# EAGLE schematic SingleFader (EAGLE 7.4.0)
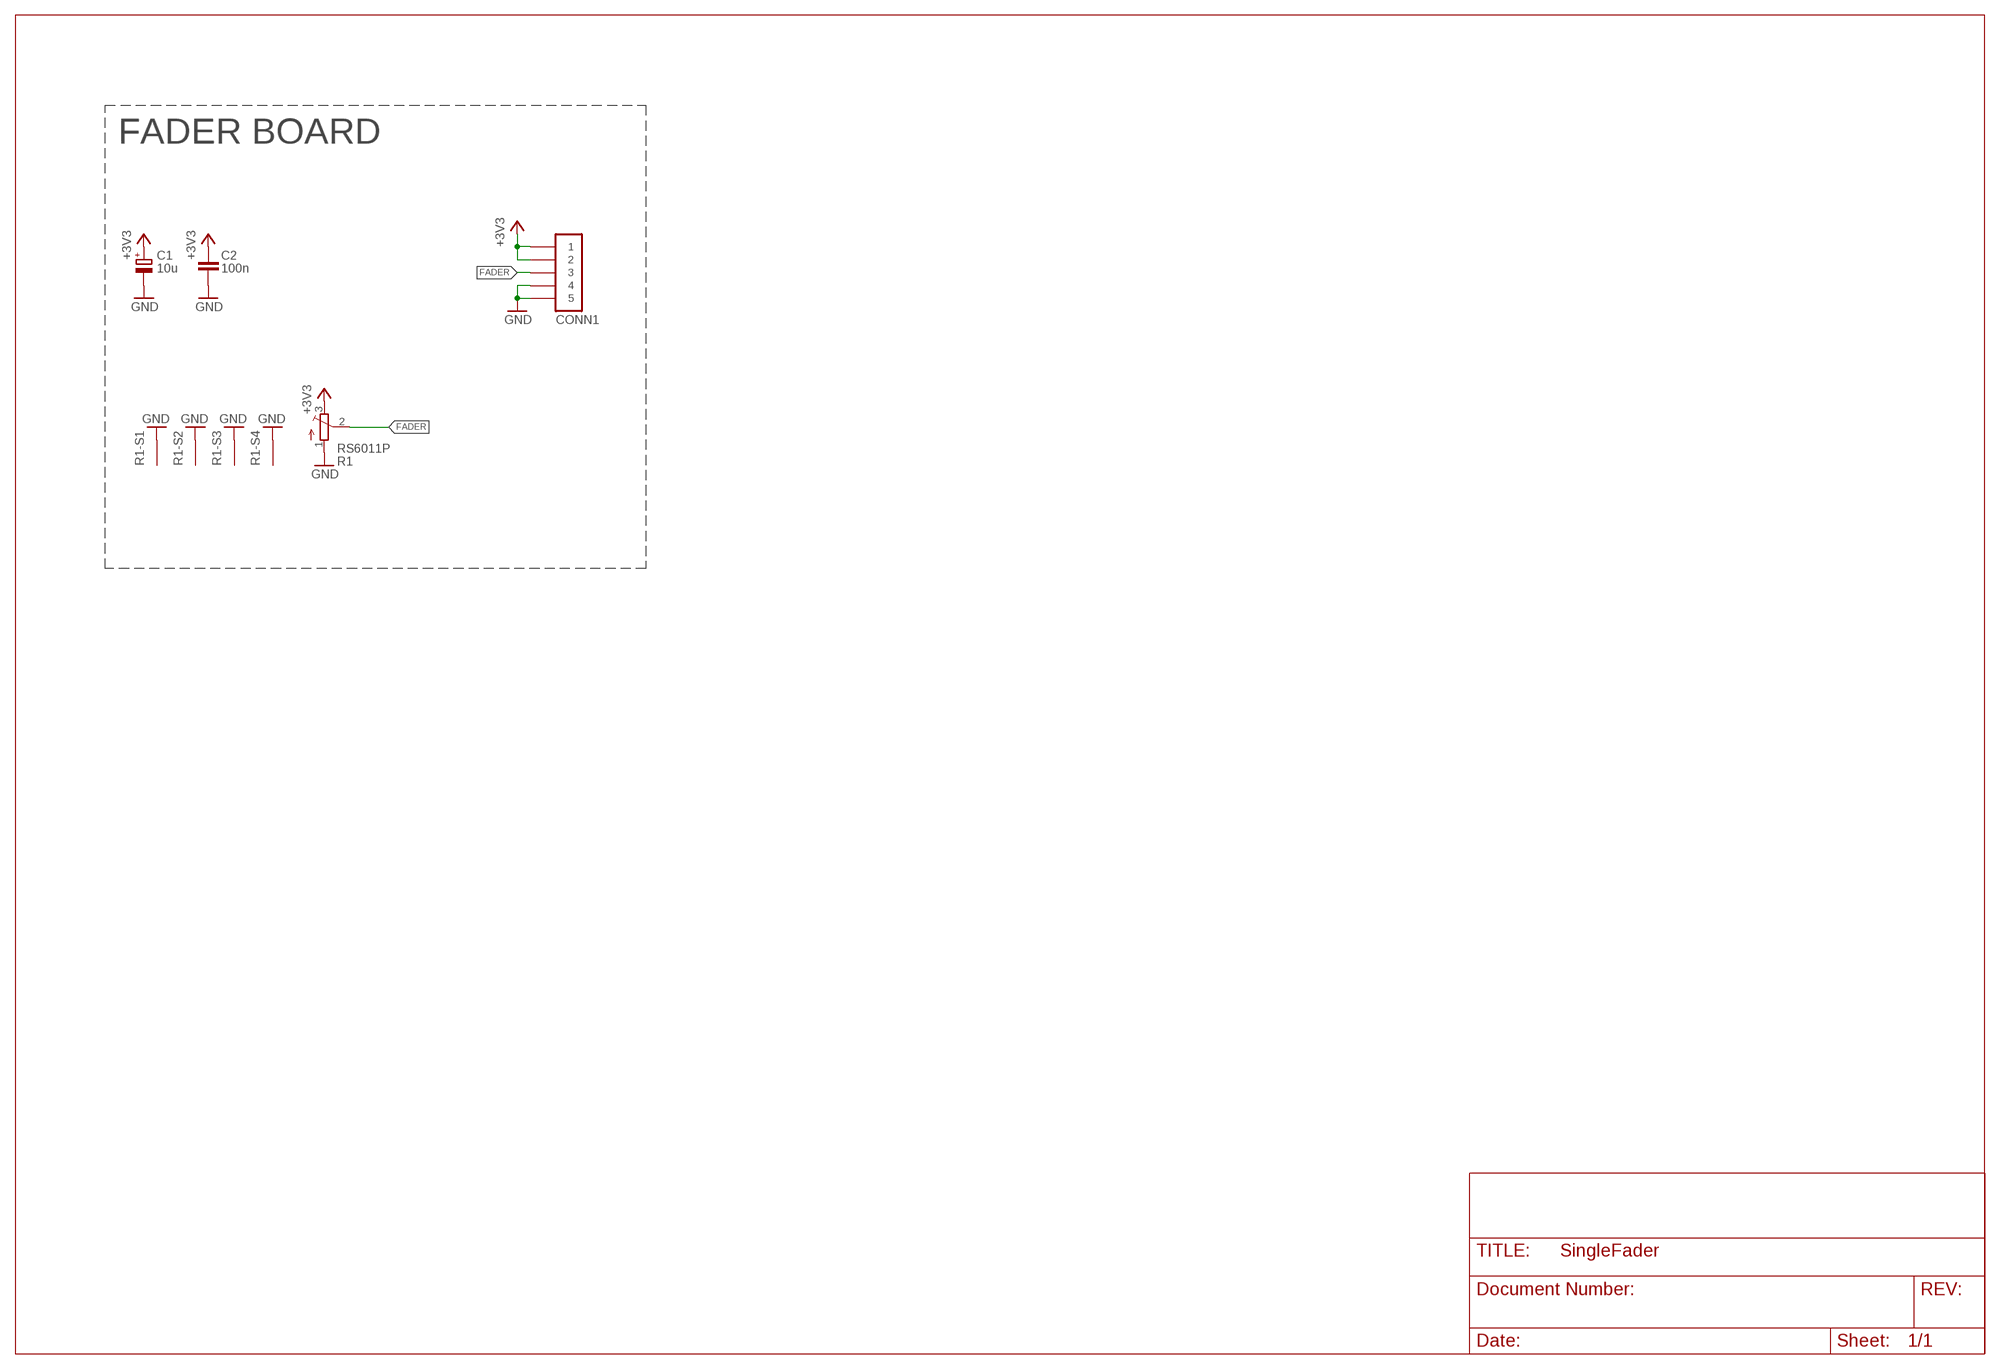
[diagram p0: schematic, sheet 1]

## Parts
C1  10u  ELECTROLYTIC_CAPACITOR16V-CLV-0405  [153CLV-0405]
C2  100n  CAPACITOR-0805  [C0805]
CONN1  PINHD-1X05-FFC-1MM-Z  [MOLEX-52271-0579]
R1  RS6011P  [RS6011*P]

## Nets
+3V3: C1.+ C2.1 CONN1.1 CONN1.2 R1.3
FADER: CONN1.3 R1.2
GND: C1.- C2.2 CONN1.4 CONN1.5 R1.1 R1.S1(S) R1.S2(S) R1.S3(S) R1.S4(S)
Unconnected: R1.S5(S)

## Notes on the sheet
- FADER BOARD

## Library data of the parts
C1 = igor_lbr:ELECTROLYTIC_CAPACITOR: Electrolytic capacitor; MANUFACTURER: Multicomp; MPN: MCVVT016M100CA1L
C2 = igor_lbr:CAPACITOR: Capacitor
CONN1 = igor_lbr:PINHD-1X05: Pin Header; MANUFACTURER: Molex; MPN: 52271-0579
R1 = igor_lbr:RS6011*P: Potentiometer